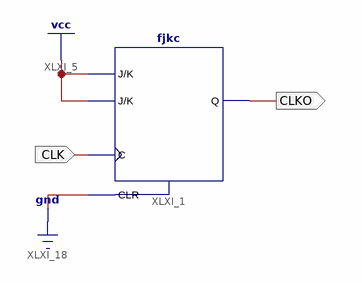
[diagram p0: schematic sheet 1]
// Xilinx ISE schematic clkdiv2.sch (spartan6) as structural Verilog: 1 symbols, 2 ports
module clkdiv2 (
  input  CLK,
  output CLKO
);

  fjkc XLXI_1 (.C(CLK), .CLR(1'b0), .J(1'b1), .K(1'b1), .Q(CLKO));
endmodule
